# Altium schematic sheet 7_Storage and distribution I.schdoc
size 497 x 243 mm; Name: A_A4; Symbol: A_A4; Device: A_A4; @Project Name: TUD-EnergyHarvestingConsole_2022-08-29_17-01-09; REV: 1.0; Date: 2022-07-23; Sheet: 1/1; Draw By: Alejandro Cabrerizo; Convert to PCB: yes; Add into BOM: yes
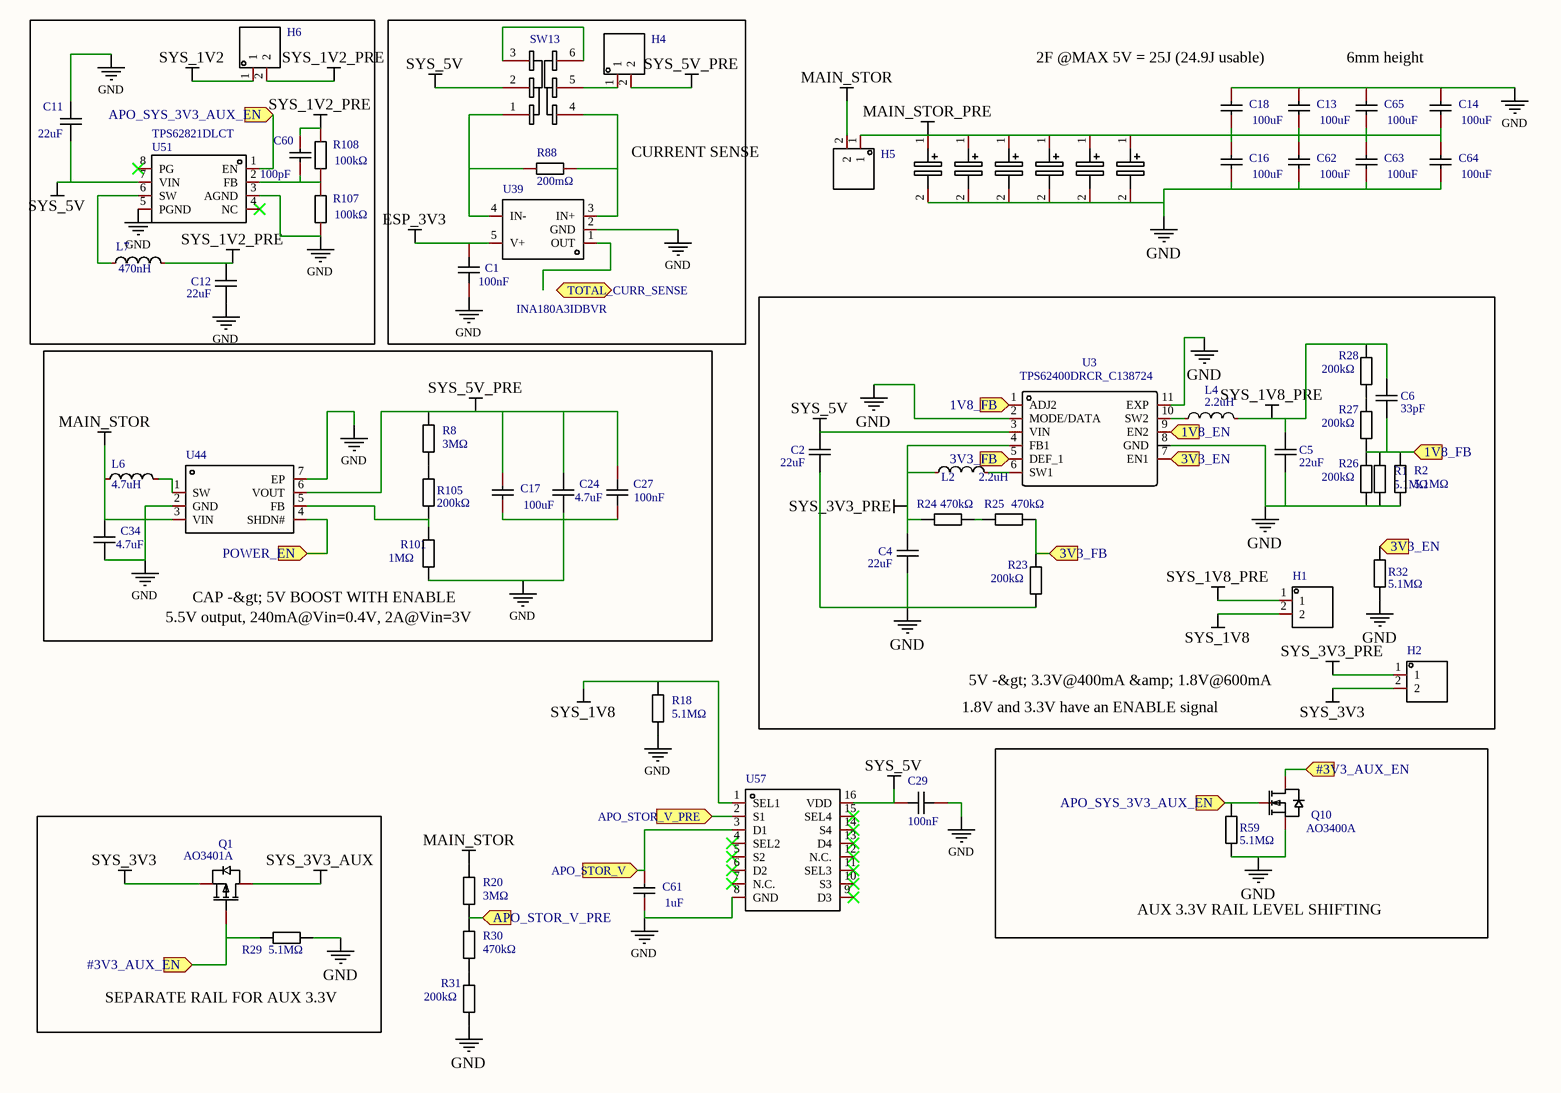
[diagram p0: 7_Storage and distribution I.schdoc]

## Parts
C1  100nF  [C0603]
C2  22uF  [C1206]
C4  22uF  [C1206]
C5  22uF  [C1206]
C6  33pF  [C0603]
C11  22uF  [C1206]
C12  22uF  [C1206]
C13  value 100uF  [C1206]  (hidden comment: CL31A107MQHNNNE)
C14  value 100uF  [C1206]  (hidden comment: CL31A107MQHNNNE)
C16  100uF  [C1206]
C17  100uF  [C1206]
C18  value 100uF  [C1206]  (hidden comment: CL31A107MQHNNNE)
C24  4.7uF  [C0603]
C27  100nF  [C0603]
C29  100nF  [C0603]
C34  4.7uF  [C0603]
C60  100pF  [C0603]
C61  1uF  [C0603]
C62  100uF  [C1206]
C63  value 100uF  [C1206]  (hidden comment: CL31A107MQHNNNE)
C64  value 100uF  [C1206]  (hidden comment: CL31A107MQHNNNE)
C65  value 100uF  [C1206]  (hidden comment: CL31A107MQHNNNE)
H1  HDR-M_2.54_1x2P  [HDR-TH_2P-P2.54-V-M-1]  (value not drawn)
H2  HDR-M_2.54_1x2P  [HDR-TH_2P-P2.54-V-M-1]  (value not drawn)
H4  HDR-M_2.54_1x2P  [HDR-TH_2P-P2.54-V-M-1]  (value not drawn)
H5  HDR-M_2.54_1x2P  [HDR-TH_2P-P2.54-V-M-1]  (value not drawn)
H6  HDR-M_2.54_1x2P  [HDR-TH_2P-P2.54-V-M-1]  (value not drawn)
L2  2.2uH  [IND-SMD_L4.0-W4.0_SMNR4020]
L4  2.2uH  [IND-SMD_L4.0-W4.0_SMNR4020]
L6  value 4.7uH  [IND-SMD_L5.0-W5.0]  (hidden comment: SWPA5040S4R7NT)
L7  470nH  [IND-SMD_L5.0-W5.0]
Q1  AO3401A  [SOT-23_L2.9-W1.3-P1.90-LS2.4-BR]
Q10  AO3400A  [SOT-23-3_L2.9-W1.3-P1.90-LS2.4-BR]
R1  5.1MΩ  [R0603]
R2  5.1MΩ  [R0603]
R8  3MΩ  [R0603]
R18  5.1MΩ  [R0603]
R20  3MΩ  [R0603]
R23  200kΩ  [R0603]
R24  470kΩ  [R0603]
R25  470kΩ  [R0603]
R26  200kΩ  [R0603]
R27  200kΩ  [R0603]
R28  200kΩ  [R0603]
R29  5.1MΩ  [R0603]
R30  470kΩ  [R0603]
R31  200kΩ  [R0603]
R32  5.1MΩ  [R0603]
R59  5.1MΩ  [R0603]
R88  value 200mΩ  [R1206]  (hidden comment: PT1206FR-7W0R2L)
R101  1MΩ  [R0603]
R105  200kΩ  [R0603]
R107  100kΩ  [R0603]
R108  value 100kΩ  [R0603]  (hidden comment: 0603WAF1003T5E)
SW13  K3-2235D-F1  [SW-TH_K3-2235D-F1]  (value not drawn)
U1  KR-5R5H224-R  [KR5R5H224R]  (value not drawn)
U3  TPS62400DRCR_C138724  [VSON-10_L3.0-W3.0-P0.50-TL-EP]
U12  KR-5R5H224-R  [KR5R5H224R]  (value not drawn)
U13  KR-5R5H224-R  [KR5R5H224R]  (value not drawn)
U15  KR-5R5H224-R  [KR5R5H224R]  (value not drawn)
U16  KR-5R5H224-R  [KR5R5H224R]  (value not drawn)
U39  INA180A3IDBVR  [SOT-23-5_L3.0-W1.7-P0.95-LS2.8-BR]
U44  LTC3526LEDC#TRPBF  [DFN-6_L2.0-W2.0-P0.50-BL-EP]  (value not drawn)
U46  KR-5R5H224-R  [KR5R5H224R]  (value not drawn)
U51  TPS62821DLCT  [VSON-8_L2.0-W1.5-P0.50-BL]
U57  TMUX1511RSVR  [UTQFN-16_L2.6-W1.8-P0.40-BL]  (value not drawn)

## Blocks framed on the sheet
CURRENT SENSE: C1 H4 R88 SW13 U39
AUX 3.3V RAIL LEVEL SHIFTING: Q10 R59
SEPARATE RAIL FOR AUX 3.3V: Q1 R29

## Ports
1V8_EN (in), 1V8_FB (in), 3V3_EN (in), 3V3_FB (in), #3V3_AUX_EN (in), APO_STOR_V (in), APO_STOR_V_PRE (in), APO_SYS_3V3_AUX_EN (in), POWER_EN (in), TOTAL_CURR_SENSE (bidir)

## Nets
ESP_3V3: C1.2 U39.5(V+)
GND: C1.1 C2.1 C4.1 C5.1 C11.2 C12.1 C13.2 C14.2 C16.1 C17.1 C18.2 C24.1 C27.2 C29.2 C34.1 C61.1 C62.1 C63.1 C64.1 C65.2 Q10.2(S) R1.2 R2.2 R18.2 R23.1 R26.1 R29.1 R31.1 R32.2 R59.2 R101.1 R107.1 U1.2(-) U3.2(MODE/DATA) U3.8(GND) U3.11(EXP) U12.2(-) U13.2(-) U15.2(-) U16.2(-) U39.2(GND) U44.2(GND) U44.7(EP) U46.2(-) U51.3(AGND) U51.5(PGND) U57.8(GND)
MAIN_STOR: C34.2 H5.2 L6.1 R20.2 U44.3(VIN)
MAIN_STOR_PRE: C13.1 C14.1 C16.2 C18.1 C62.2 C63.2 C64.2 C65.1 H5.1 U1.1(+) U12.1(+) U13.1(+) U15.1(+) U16.1(+) U46.1(+)
SYS_1V2: H6.1
SYS_1V2_PRE: C12.2 C60.2 H6.2 L7.2 R108.2
SYS_1V8: H1.2 R18.1 U57.1(SEL1)
SYS_1V8_PRE: C5.2 C6.2 H1.1 L4.2 R28.2
SYS_3V3: H2.2 Q1.2(S)
SYS_3V3_AUX: Q1.3(D)
SYS_3V3_PRE: C4.2 H2.1 L2.1 R24.2 U3.4(FB1)
SYS_5V: C2.2 C11.1 C29.1 SW13.2 U3.3(VIN) U51.7(VIN) U57.16(VDD)
SYS_5V_PRE: C17.2 C24.2 C27.1 H4.2 R8.2 U44.6(VOUT)
1V8_EN: U3.9(EN2) ; port 1V8_EN
1V8_FB: C6.1 R1.1 R2.1 R26.2 R27.1 U3.1(ADJ2) ; port 1V8_FB
3V3_EN: R32.1 U3.7(EN1) ; port 3V3_EN
3V3_FB: R23.2 R25.1 U3.5(DEF_1) ; port 3V3_FB
#3V3_AUX_EN: Q1.1(G) Q10.3(D) R29.2 ; port #3V3_AUX_EN
APO_STOR_V: C61.2 U57.3(D1) ; port APO_STOR_V
APO_STOR_V_PRE: R20.1 R30.1 U57.2(S1) ; port APO_STOR_V_PRE
APO_SYS_3V3_AUX_EN: Q10.1(G) R59.1 U51.1(EN) ; port APO_SYS_3V3_AUX_EN
POWER_EN: U44.4(SHDN#) ; port POWER_EN
NetC60_1: C60.1 R107.2 R108.1 U51.2(FB)
NetH4_1: H4.1 SW13.5
NetL2_2: L2.2 U3.6(SW1)
NetL4_1: L4.1 U3.10(SW2)
NetL6_2: L6.2 U44.1(SW)
NetL7_1: L7.1 U51.6(SW)
NetR8_1: R8.1 R105.1
NetR24_1: R24.1 R25.2
NetR27_2: R27.2 R28.1
NetR30_2: R30.2 R31.2
NetR88_1: R88.1 SW13.1 U39.4(IN-)
NetR88_2: R88.2 SW13.4 U39.3(IN+)
NetR101_2: R101.2 R105.2 U44.5(FB)
NetSW13_3: SW13.3 SW13.6

Not connected (* = marked no-connect by the designer): U39 1(OUT); U51 4(NC)* 8(PG)*; U57 4(SEL2)* 5(S2)* 6(D2)* 7(N.C.)* 9(D3)* 10(S3)* 11(SEL3)* 12(N.C.)* 13(D4)* 14(S4)* 15(SEL4)*

## Notes on the sheet
- 2F @MAX 5V = 25J (24.9J usable)
- 6mm height
- (near R101) CAP -&gt; 5V BOOST WITH ENABLE
- (near R101) 5.5V output, 240mA@Vin=0.4V, 2A@Vin=3V
- 1.8V and 3.3V have an ENABLE signal
- 5V -&gt; 3.3V@400mA &amp; 1.8V@600mA
- 1
- 2
- 3
- 4
- 5
- A
- B
- C
- D
- TITLE:
- TUD-EnergyHarvestingConsole_2022-08-29_17-01-09
- REV:
- 1.0
- Date:
- Company:
- 2022-07-23
- Drawn By:
- Alejandro Cabrerizo
- Sheet:
- 1/1

## Library data of the parts
C1 C29 = CC0603KRX7R9BB104: Manufacturer: YAGEO; Convert to PCB: yes; NAME: 2; Name: 100nF; Symbol: 100nF; Device: CC0603KRX7R9BB104; Supplier: LCSC; Manufacturer Part: CC0603KRX7R9BB104; Supplier Part: C14663; JLCPCB Part Class: Basic; Add into BOM: yes; Origin Footprint: C0603; NUMBER: 2
C2 C4 C5 C11 C12 = CL31A226KPHNNNE: Manufacturer: SAMSUNG; Convert to PCB: yes; Name: 22uF; Symbol: 22uF; Device: CL31A226KPHNNNE; Supplier: LCSC; Manufacturer Part: CL31A226KPHNNNE; Supplier Part: C5672; JLCPCB Part Class: Basic Part; Add into BOM: yes; Origin Footprint: C1206
C6 = CL10C330JB8NNNC: Manufacturer: SAMSUNG; Convert to PCB: yes; Name: 33pF; Symbol: 33pF; Device: CL10C330JB8NNNC; Supplier: LCSC; Manufacturer Part: CL10C330JB8NNNC; Supplier Part: C1663; JLCPCB Part Class: Basic Part; Add into BOM: yes; Origin Footprint: C0603
C13 C14 C16-C18 C62-C65 = CL31A107MQHNNNE: Capacitance: Tolerance:±20% Tolerance:±20% Voltage Rated: Temperature Coefficient:; Manufacturer: SAMSUNG(三星); Add into BOM: yes; Tolerance: ±20%; Name: 100uF; Symbol: CL31A107MQHNNNE; Device: CL31A107MQHNNNE; LCSC Part Name: 100uF ±20% 6.3V; Supplier Part: C15008; Manufacturer Part: CL31A107MQHNNNE; Supplier Footprint: 1206; JLCPCB Part Class: Basic Part; Datasheet: https://atta.szlcsc.com/upload/public/pdf/source/20160103/1457707673200.pdf; Supplier: LCSC; Convert to PCB: yes
  C16 C17 C62: Value: 100uF
C24 C34 = CL10A475KO8NNNC: Manufacturer: SAMSUNG; Convert to PCB: yes; Name: 4.7uF; Symbol: 4.7uF; Device: CL10A475KO8NNNC; Supplier: LCSC; Manufacturer Part: CL10A475KO8NNNC; Supplier Part: C19666; JLCPCB Part Class: Basic Part; Add into BOM: yes; Origin Footprint: C0603
C27 = CC0603KRX7R9BB104: Manufacturer: YAGEO; Convert to PCB: yes; Name: 100nF; Symbol: 100nF; Device: CC0603KRX7R9BB104; Supplier: LCSC; Manufacturer Part: CC0603KRX7R9BB104; Supplier Part: C14663; JLCPCB Part Class: Basic; Add into BOM: yes; Origin Footprint: C0603
C60 = CL10C101JB8NNNC: Capacitance: Tolerance:±5% Tolerance:±5% Voltage Rated: Temperature Coefficient:; Manufacturer: SAMSUNG(三星); Add into BOM: yes; Tolerance: ±5%; Name: 100pF; Symbol: CL10C101JB8NNNC; Device: CL10C101JB8NNNC; LCSC Part Name: 100pF ±5% 50V; Supplier Part: C14858; Manufacturer Part: CL10C101JB8NNNC; Supplier Footprint: 0603; JLCPCB Part Class: Basic Part; Datasheet: https://atta.szlcsc.com/upload/public/pdf/source/20160103/1457707672333.pdf; Supplier: LCSC; Convert to PCB: yes; Value: 100pF
C61 = CL10A105KB8NNNC: Capacitance: Tolerance:±10% Tolerance:±10% Voltage Rated: Temperature Coefficient:; Manufacturer: SAMSUNG(三星); Add into BOM: yes; Tolerance: ±10%; Name: 1uF; Symbol: CL10A105KB8NNNC; Device: CL10A105KB8NNNC; LCSC Part Name: 1uF ±10% 50V; Supplier Part: C15849; Manufacturer Part: CL10A105KB8NNNC; Supplier Footprint: 0603; JLCPCB Part Class: Basic Part; Datasheet: https://atta.szlcsc.com/upload/public/pdf/source/20160103/1457707679084.pdf; Supplier: LCSC; Convert to PCB: yes; Value: 1uF
H1 H2 H4-H6 = HDR-M_2.54_1x2P: Symbol: 210S-1*2P L=11.6MMGold-plated black; Convert to PCB: yes; Device: HDR-M_2.54_1x2P; Add into BOM: yes; Supplier Footprint: Through
L2 L4 = SMNR4020-2.2UH: Manufacturer: SXN; Convert to PCB: yes; Name: 2.2uH; Symbol: 2.2uH; Device: SMNR4020-2.2UH; Supplier: LCSC; Manufacturer Part: SMNR4020-2.2UH; Supplier Part: C135262; JLCPCB Part Class: Extended Part; Add into BOM: yes; Origin Footprint: IND-SMD_L4.0-W4.0_SMNR4020
L6 = SWPA5040S4R7NT: Inductance: Tolerance: Tolerance: Rated Current: Saturation Current (Isat):- DC Resistance (DCR):; Manufacturer: Sunlord(顺络); Add into BOM: yes; Symbol: SWPA5040S4R7NT; Device: SWPA5040S4R7NT; LCSC Part Name: 4.7uH ±30% 3A 30mΩ; Supplier Part: C305174; Manufacturer Part: SWPA5040S4R7NT; Supplier Footprint: SMD; JLCPCB Part Class: Extended Part; Datasheet: https://atta.szlcsc.com/upload/public/pdf/source/20210916/AC798BA7E846B7D0B6818F45CD84DB0B.pdf; Supplier: LCSC; Convert to PCB: yes; Saturation Current (Isat): -
L7 = CR5020-R47N: Tolerance: Tolerance: Inductance: Length: Width: Rated Current:- DC Resistance (DCR):- Height:; Manufacturer: ceaiya(柯爱亚); Add into BOM: yes; Name: 470nH; Symbol: CR5020-R47N; Device: CR5020-R47N; LCSC Part Name: 470nH ±30%; Supplier Part: C520328; Manufacturer Part: CR5020-R47N; Supplier Footprint: SMD; JLCPCB Part Class: Extended Part; Datasheet: https://atta.szlcsc.com/upload/public/pdf/source/20200424/C520276_8639ABF18B4A41322D74F24464FD005B.pdf; Supplier: LCSC; Convert to PCB: yes; Value: 470nH; Rated Current: -; DC Resistance (DCR): -
Q1 = AO3401A: Manufacturer: AOS; Convert to PCB: yes; Name: AO3401A; Symbol: AO3401A; Device: AO3401A; Supplier: LCSC; Manufacturer Part: AO3401A; Supplier Part: C15127; JLCPCB Part Class: Basic Part; Add into BOM: yes; Origin Footprint: SOT-23_L2.9-W1.3-P1.90-LS2.4-BR
Q10 = AO3400A: Manufacturer: HUASHUO(华朔); Convert to PCB: yes; Name: AO3400A; Symbol: AO3400A; Device: AO3400A; Supplier: LCSC; Supplier Part: C700953; Manufacturer Part: AO3400A; JLCPCB Part Class: Extended Part; Add into BOM: yes; Origin Footprint: SOT-23-3_L2.9-W1.3-P1.90-LS2.4-BR
R1 = 0603WAF5104T5E: Manufacturer: UniOhm; Resistance: 5.1M; Convert to PCB: yes; Add into BOM: no; Name: 5.1MΩ; Symbol: 5.1MΩ; Device: 0603WAF5104T5E; Supplier: LCSC; Manufacturer Part: 0603WAF5104T5E; Supplier Part: C13320; JLCPCB Part Class: Basic Part; Origin Footprint: R0603
R2 = 0603WAF5104T5E: Manufacturer: UniOhm; Resistance: 5.1M; Convert to PCB: yes; Add into BOM: no; NAME: 1; Name: 5.1MΩ; Symbol: 5.1MΩ; Device: 0603WAF5104T5E; Supplier: LCSC; Manufacturer Part: 0603WAF5104T5E; Supplier Part: C13320; JLCPCB Part Class: Basic Part; Origin Footprint: R0603; NUMBER: 1
R8 = 0603WAF3004T5E: Manufacturer: UniOhm; Resistance: 3M; Convert to PCB: yes; Name: 3MΩ; Symbol: 3MΩ; Device: 0603WAF3004T5E; Supplier: LCSC; Manufacturer Part: 0603WAF3004T5E; Supplier Part: C23156; JLCPCB Part Class: Basic Part; Add into BOM: yes; Origin Footprint: R0603
R18 = 0603WAF5104T5E: Manufacturer: UniOhm; Resistance: 5.1M; Convert to PCB: yes; NAME: 1; Name: 5.1MΩ; Symbol: 5.1MΩ; Device: 0603WAF5104T5E; Supplier: LCSC; Manufacturer Part: 0603WAF5104T5E; Supplier Part: C13320; JLCPCB Part Class: Basic Part; Add into BOM: yes; Origin Footprint: R0603; NUMBER: 1
R20 = 0603WAF3004T5E: Manufacturer: UniOhm; Resistance: 3M; Convert to PCB: yes; NUMBER: 1; Name: 3MΩ; Symbol: 3MΩ; Device: 0603WAF3004T5E; Supplier: LCSC; Manufacturer Part: 0603WAF3004T5E; Supplier Part: C23156; JLCPCB Part Class: Basic Part; Add into BOM: yes; Origin Footprint: R0603
R23 R26-R28 R105 = 0603WAF2003T5E: Manufacturer: UniOhm; Resistance: 200K; Convert to PCB: yes; Name: 200kΩ; Symbol: 200kΩ; Device: 0603WAF2003T5E; Supplier: LCSC; Manufacturer Part: 0603WAF2003T5E; Supplier Part: C25811; JLCPCB Part Class: Basic Part; Add into BOM: yes; Origin Footprint: R0603
R24 R25 R30 = 0603WAF4703T5E: Manufacturer: UniOhm; Resistance: 470K; Convert to PCB: yes; Name: 470kΩ; Symbol: 470kΩ; Device: 0603WAF4703T5E; Supplier: LCSC; Manufacturer Part: 0603WAF4703T5E; Supplier Part: C23178; JLCPCB Part Class: Basic Part; Add into BOM: yes; Origin Footprint: R0603
R29 R32 R59 = 0603WAF5104T5E: Manufacturer: UniOhm; Resistance: 5.1M; Convert to PCB: yes; Name: 5.1MΩ; Symbol: 5.1MΩ; Device: 0603WAF5104T5E; Supplier: LCSC; Manufacturer Part: 0603WAF5104T5E; Supplier Part: C13320; JLCPCB Part Class: Basic Part; Add into BOM: yes; Origin Footprint: R0603
R31 = 0603WAF2003T5E: Manufacturer: UniOhm; Resistance: 200K; Convert to PCB: yes; NUMBER: 2; Name: 200kΩ; Symbol: 200kΩ; Device: 0603WAF2003T5E; Supplier: LCSC; Manufacturer Part: 0603WAF2003T5E; Supplier Part: C25811; JLCPCB Part Class: Basic Part; Add into BOM: yes; Origin Footprint: R0603
R88 = PT1206FR-7W0R2L: Resistance:200mΩ Tolerance:±1% Tolerance:±1% Power(Watts):500mW Temperature Coefficient:±75ppm/ Temperature Coefficient:±75ppm/; Manufacturer: YAGEO(国巨); Add into BOM: yes; Tolerance: ±1%; Power(Watts): 500mW; Temperature Coefficient: ±75ppm/; Symbol: PT1206FR-7W0R2L; Device: PT1206FR-7W0R2L; LCSC Part Name: 200mΩ ±1% 500mW; Supplier Part: C309533; Manufacturer Part: PT1206FR-7W0R2L; Supplier Footprint: 1206; JLCPCB Part Class: Extended Part; Datasheet: https://atta.szlcsc.com/upload/public/pdf/source/20181009/C309533_F78C98CB1D9D957DE850743D14CFF519.pdf; Supplier: LCSC; Convert to PCB: yes
R101 = 0603WAF1004T5E: Manufacturer: UniOhm; Resistance: 1M; Convert to PCB: yes; Name: 1MΩ; Symbol: 1MΩ; Device: 0603WAF1004T5E; Supplier: LCSC; Manufacturer Part: 0603WAF1004T5E; Supplier Part: C22935; JLCPCB Part Class: Basic Part; Add into BOM: yes; Origin Footprint: R0603
R107 R108 = 0603WAF1003T5E: Type:Thick Film Resistors Resistance: Tolerance:±1% Tolerance:±1% Power(Watts): Temperature Coefficient:±100ppm/℃ Temperature Coefficient:±100ppm/℃ Overload Voltage (Max): Operating Temperature Range:-55℃~+155℃ Operating Temperature Range:-55℃~+155℃; Manufacturer: UNI-ROYAL(厚声); Add into BOM: yes; Tolerance: ±1%; Name: 100kΩ; Symbol: 0603WAF1003T5E; Device: 0603WAF1003T5E; LCSC Part Name: 100kΩ ±1% 100mW; Supplier Part: C25803; Manufacturer Part: 0603WAF1003T5E; Supplier Footprint: 0603; JLCPCB Part Class: Basic Part; Datasheet: https://atta.szlcsc.com/upload/public/pdf/source/20200306/C422600_1E6D84923E4A46A82E41ADD87F860B5C.pdf; Supplier: LCSC; Convert to PCB: yes; Type: Thick Film Resistors; Temperature Coefficient: ±100ppm/℃; Operating Temperature Range: -55℃~+155℃
  R107: Value: 100kΩ
SW13 = K3-2235D-F1: Current Rating (DC):300mA Voltage Rating (DC):6V Current Rating (AC):- Voltage Rating (AC):- Circuit:双刀双掷 Mounting Style:直插 Mechanical Life:10000 Actuator Color:黑色 Actuator Style:矩形柱状 Pin Style:PC引脚 Operating Temperature:-25~+80 Operating Temperature:-2; Manufacturer: 韩国韩荣; Add into BOM: yes; Current Rating (DC): 300mA; Voltage Rating (DC): 6V; Circuit: 双刀双掷; Mechanical Life: 10000; Actuator Color: 黑色; Actuator Style: 矩形柱状; Pin Style: PC引脚; Switch Length: 9mm; Switch Width: 3.5mm; Symbol: K3-2235D-F1; Device: K3-2235D-F1; LCSC Part Name: K3-2235D-F1; Supplier Part: C189615; Manufacturer Part: K3-2235D-F1; Supplier Footprint: 插件; JLCPCB Part Class: Extended Part; Datasheet: https://atta.szlcsc.com/upload/public/pdf/source/20210810/9F56F04DF7CBA8FC4D1B091DF1444945.pdf; Supplier: LCSC; Convert to PCB: yes; Current Rating (AC): -; Voltage Rating (AC): -; Mounting Style: 直插; Operating Temperature: -25~+80; Switch Height: 3.5mm
U1 U12 U13 U15 U16 U46 = KR-5R5H224-R: Add into BOM: yes; Symbol: KR-5R5H224-R; Device: KR-5R5H224-R; Convert to PCB: yes
  U1 U12 U13 U15 U16: NAME: -
U3 = TPS62400DRCR: Manufacturer: TI; Convert to PCB: yes; Name: TPS62400DRCR_C138724; Symbol: TPS62400DRCR_C138724; Device: TPS62400DRCR; Supplier: LCSC; Manufacturer Part: TPS62400DRCR; Supplier Part: C138724; JLCPCB Part Class: Extended Part; Add into BOM: yes; Origin Footprint: VSON-10_L3.0-W3.0-P0.50-TL-EP
U39 = INA180A3IDBVR: Manufacturer: TI(德州仪器); Add into BOM: yes; Symbol: INA180A3IDBVR; Device: INA180A3IDBVR; LCSC Part Name: INA180A3IDBVR; Supplier Part: C122882; Manufacturer Part: INA180A3IDBVR; Supplier Footprint: SOT-23-5; JLCPCB Part Class: Extended Part; Datasheet: https://atta.szlcsc.com/upload/public/pdf/source/20171014/C122882_15079752744071037935.pdf; Supplier: LCSC; Convert to PCB: yes
U44 = LTC3526LEDC#TRPBF: Manufacturer: ADI(亚德诺)/LINEAR; Add into BOM: yes; Symbol: LTC3526LEDC#TRPBF; Device: LTC3526LEDC#TRPBF; LCSC Part Name: LTC3526LEDC#TRPBF; Supplier Part: C684883; Manufacturer Part: LTC3526LEDC#TRPBF; Supplier Footprint: DFN-6; JLCPCB Part Class: Extended Part; Datasheet: https://atta.szlcsc.com/upload/public/pdf/source/20200812/C684880_5FAAD681016692C402F32348F389CC4B.pdf; Supplier: LCSC; Convert to PCB: yes
U51 = TPS62821DLCT: Function:Step-down type Synchronous Rectification:Yes Output Type:Adjustable Number of Outputs:1 Topology:Step-down Input Voltage:2.4V~5.5V Input Voltage:2.4V~5.5V Output Voltage:0.6V~4V Output Voltage:0.6V~4V Output Current (Max):1A Switching Frequency:2; Manufacturer: TI(德州仪器); Add into BOM: yes; Number of Outputs: 1; Output Current (Max): 1A; Switching Frequency: 2.2MHz; Name: TPS62821DLCT; Symbol: TPS62821DLCT; Device: TPS62821DLCT; LCSC Part Name: 降压型 Vin=2.4V~5.5V Vout=600mV~4V 1A; Supplier Part: C2072013; Manufacturer Part: TPS62821DLCT; Supplier Footprint: VSON-8(1.5x2); JLCPCB Part Class: Extended Part; Supplier: LCSC; Convert to PCB: yes; Function: Step-down type; Synchronous Rectification: Yes; Output Type: Adjustable; Topology: Step-down; Input Voltage: 2.4V~5.5V; Output Voltage: 0.6V~4V; Operating Temperature: -40℃~+125℃@(TJ)
U57 = TMUX1511RSVR: Switch Circuit:-; Manufacturer: TI(德州仪器); Add into BOM: yes; Name: TMUX1511RSVR; Symbol: TMUX1511RSVR; Device: TMUX1511RSVR; LCSC Part Name: TMUX1511RSVR; Supplier Part: C2673275; Manufacturer Part: TMUX1511RSVR; Supplier Footprint: UTQFN-16(1.8x2.6); JLCPCB Part Class: Extended Part; Supplier: LCSC; Convert to PCB: yes; Switch Circuit: -